# Altium project 2025 Bright MFG Challenge-MTU ECE1.PrjPcb
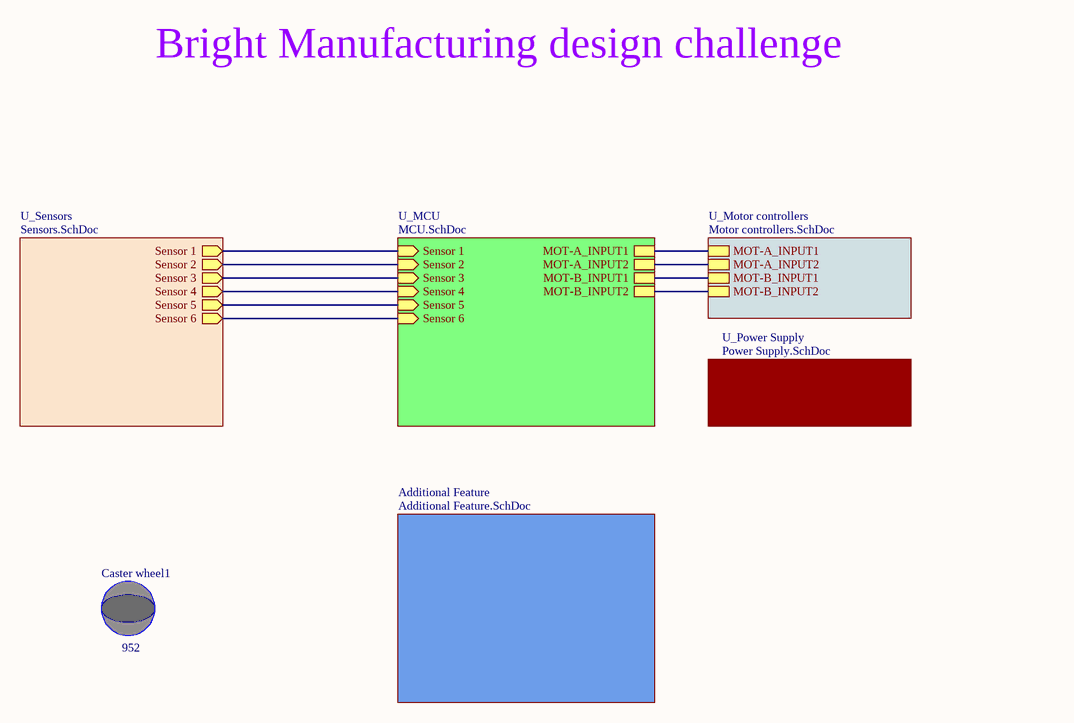
[diagram p0: Global.SchDoc]
6 sheets, 91 parts. Net scope: global (net labels, ports and power ports of the same name join across sheets).
Board file: Bright MFG Robot.PcbDoc
Sheets:
  Global.SchDoc
    U_MCU = MCU.SchDoc
    U_Motor controllers = Motor controllers.SchDoc
    U_Power Supply = Power Supply.SchDoc
    U_Sensors = Sensors.SchDoc
    Additional Feature = Additional Feature.SchDoc

## Sheet Global.SchDoc
size 431 x 279 mm; SheetNumber: 1; SheetTotal: 6

### Parts
Caster_wheel1  952  [952-Footprint-1]

### Sub-sheets
Additional Feature = Additional Feature.SchDoc: no entries
U_MCU = MCU.SchDoc: MOT-A_INPUT1, MOT-B_INPUT1, MOT-A_INPUT2, MOT-B_INPUT2, Sensor 1 (in), Sensor 2 (in), Sensor 3 (in), Sensor 4 (in), Sensor 5 (in), Sensor 6 (in)
U_Motor controllers = Motor controllers.SchDoc: MOT-A_INPUT1, MOT-B_INPUT1, MOT-A_INPUT2, MOT-B_INPUT2
U_Power Supply = Power Supply.SchDoc: no entries
U_Sensors = Sensors.SchDoc: Sensor 1 (out), Sensor 2 (out), Sensor 3 (out), Sensor 4 (out), Sensor 5 (out), Sensor 6 (out)

### Nets
(unnamed): sheet U_MCU/MOT-A_INPUT1, sheet U_Motor controllers/MOT-A_INPUT1
(unnamed): sheet U_MCU/MOT-B_INPUT1, sheet U_Motor controllers/MOT-B_INPUT1
(unnamed): sheet U_MCU/MOT-A_INPUT2, sheet U_Motor controllers/MOT-A_INPUT2
(unnamed): sheet U_MCU/MOT-B_INPUT2, sheet U_Motor controllers/MOT-B_INPUT2
(unnamed): sheet U_MCU/Sensor 1, sheet U_Sensors/Sensor 1
(unnamed): sheet U_MCU/Sensor 2, sheet U_Sensors/Sensor 2
(unnamed): sheet U_MCU/Sensor 3, sheet U_Sensors/Sensor 3
(unnamed): sheet U_MCU/Sensor 4, sheet U_Sensors/Sensor 4
(unnamed): sheet U_MCU/Sensor 5, sheet U_Sensors/Sensor 5
(unnamed): sheet U_MCU/Sensor 6, sheet U_Sensors/Sensor 6

### Notes on the sheet
- Bright Manufacturing design challenge
- 4
- 3
- DWG NO.
- REV
- 2
- 1
- DESCRIPTION
- ECO #
- DATE
- ALL INFORMATION IN THIS DRAWING IS THE PROPERTY OF EMAC, AND CANNOT BE COPIED OR USED WITHOUT THE WRITTEN APPROVAL OF EMAC.
- D
- C
- B
- TOLERANCES :
- DIMENSIONS ARE IN INCHES
- UNLESS OTHERWISE SPECIFIED
- CONTRACT NO.
- DRAWN BY
- 2025 Bright Manufacturing Challenge
- .XX
- .XXX
- SURFACE FINISH =           OR BETTER
- ±
- .005
- .01
- FRACTIONS
- ANGLES
- 63
- 1/64
- °
- CHECKED BY
- SCHEMATIC
- A
- MATERIAL
- DRAWING PER ASME-Y14.5-1994
- DEBURR & BREAK ALL SHARP EDGES.
- RESP ENGR
- SIZE
- CODE IDENT
- 0BJZ8
- FINISH
- DESIGN ACTIVITY APPROVAL
- NONE
- SCALE
- WEIGHT
- NA
- SHEET
- OF
- REV. A, 06/21/2025
- FORM #PDE-0001-0001

### Library data of the parts
Caster_wheel1 = CMP-00025-1: Ball Caster With 1/2" Plastic

## Sheet MCU.SchDoc: Master Controller Unit (MCU)
size 431 x 279 mm; DocumentNumber: BMC-125-5321; Revision: A; SheetNumber: 5; SheetTotal: 6
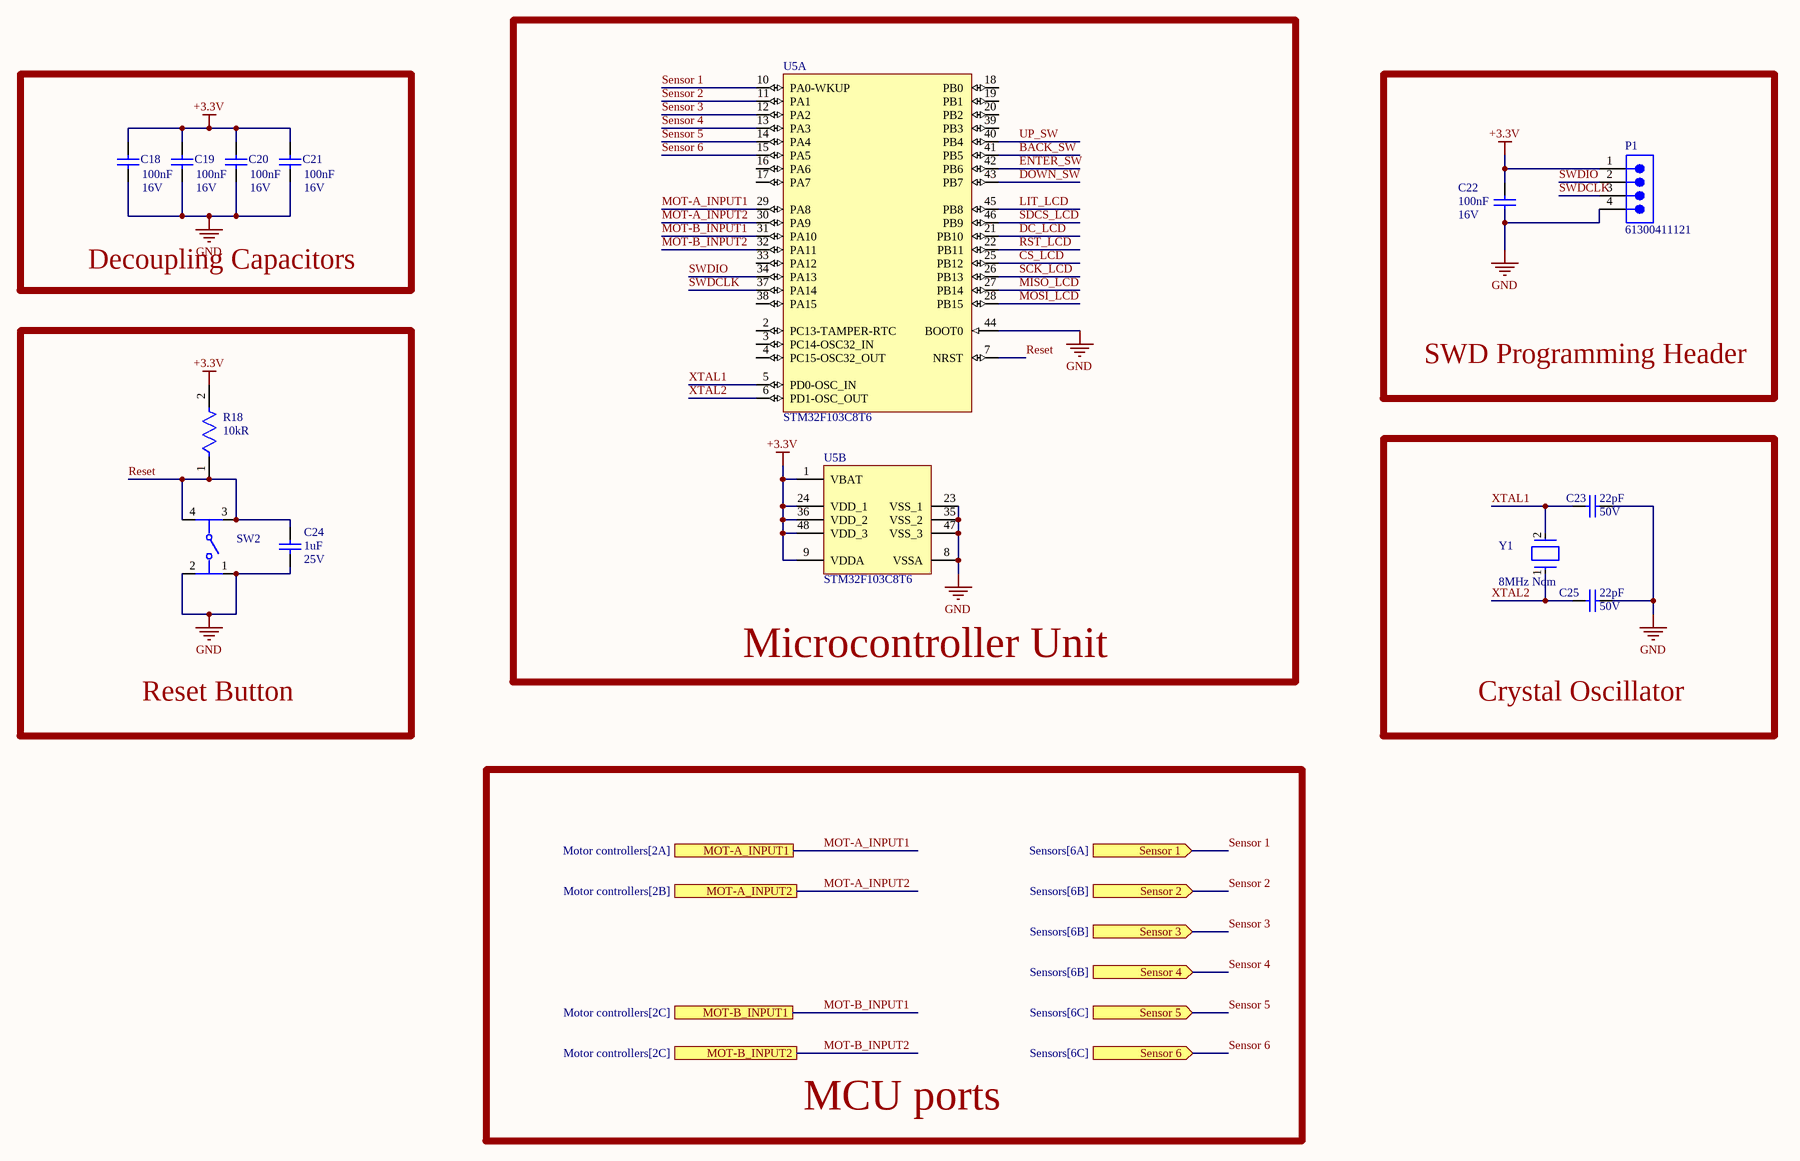
[diagram p1: MCU.SchDoc]

### Parts
C18  value 100nF  Rated DC Voltage (URdc): 16V  [CAPC1608X90X35LL15T15]  (hidden comment: 0.1uF 16V 0603)
C19  value 100nF  Rated DC Voltage (URdc): 16V  [CAPC1608X90X35LL15T15]  (hidden comment: 0.1uF 16V 0603)
C20  value 100nF  Rated DC Voltage (URdc): 16V  [CAPC1608X90X35LL15T15]  (hidden comment: 0.1uF 16V 0603)
C21  value 100nF  Rated DC Voltage (URdc): 16V  [CAPC1608X90X35LL15T15]  (hidden comment: 0.1uF 16V 0603)
C22  value 100nF  Rated DC Voltage (URdc): 16V  [CAPC1608X90X35LL15T15]  (hidden comment: 0.1uF 16V 0603)
C23  value 22pF  Voltage Rating: 50V  [FP-C0603C-CF-IPC_B]  (hidden comment: 22pF 50V 0603)
C24  value 1uF  Rated DC Voltage (URdc): 25V  [FP-CC0603-DA-IPC_B]  (hidden comment: 1uF 25V 0603)
C25  value 22pF  Voltage Rating: 50V  [FP-C0603C-CF-IPC_B]  (hidden comment: 22pF 50V 0603)
P1  61300411121  [61300411121]
R18  value 10kR  [RESC1608X55X25ML10T15]  (hidden comment: 10KOhm 0603)
SW2  PTS645SM43SMTR92LFS  [FP-PTS645SM43SMTR92LFS-MFG]  (value not drawn)
U5  STM32F103C8T6  [STM-LQFP48_M]  (parts A,B of 2)
Y1  ABLS2-8.000MHZ-D4Y-T  [FP-ABLS2-MFG]  (value not drawn)

### Blocks framed on the sheet
Microcontroller Unit: U5
Decoupling Capacitors: C18-C21
SWD Programming Header: C22 P1
Reset Button: C24 R18 SW2
Crystal Oscillator: C23 C25 Y1

### Ports
MOT-A_INPUT1 (see Motor controllers[2A]), MOT-A_INPUT2 (see Motor controllers[2B]), MOT-B_INPUT1 (see Motor controllers[2C]), MOT-B_INPUT2 (see Motor controllers[2C]), Sensor 1 (in, see Sensors[6A]), Sensor 2 (in, see Sensors[6B]), Sensor 3 (in, see Sensors[6B]), Sensor 4 (in, see Sensors[6B]), Sensor 5 (in, see Sensors[6C]), Sensor 6 (in, see Sensors[6C])

### Nets
+3.3V: C18.2 C19.2 C20.2 C21.2 C22.2 P1.1 R18.2 U5.1(VBAT) U5.9(VDDA) U5.24(VDD_1) U5.36(VDD_2) U5.48(VDD_3)
GND: C18.1 C19.1 C20.1 C21.1 C22.1 C23.1 C24.1 C25.1 P1.4 SW2.1 SW2.2 U5.8(VSSA) U5.23(VSS_1) U5.35(VSS_2) U5.44(BOOT0) U5.47(VSS_3)
BACK_SW: U5.41(PB5)
CS_LCD: U5.25(PB12)
DC_LCD: U5.21(PB10)
DOWN_SW: U5.43(PB7)
ENTER_SW: U5.42(PB6)
LIT_LCD: U5.45(PB8)
MISO_LCD: U5.27(PB14)
MOSI_LCD: U5.28(PB15)
MOT-A_INPUT1: U5.29(PA8) ; port MOT-A_INPUT1
MOT-A_INPUT2: U5.30(PA9) ; port MOT-A_INPUT2
MOT-B_INPUT1: U5.31(PA10) ; port MOT-B_INPUT1
MOT-B_INPUT2: U5.32(PA11) ; port MOT-B_INPUT2
Reset: C24.2 R18.1 SW2.3 SW2.4 U5.7(NRST)
RST_LCD: U5.22(PB11)
SCK_LCD: U5.26(PB13)
SDCS_LCD: U5.46(PB9)
Sensor 1: U5.10(PA0-WKUP) ; port Sensor 1
Sensor 2: U5.11(PA1) ; port Sensor 2
Sensor 3: U5.12(PA2) ; port Sensor 3
Sensor 4: U5.13(PA3) ; port Sensor 4
Sensor 5: U5.14(PA4) ; port Sensor 5
Sensor 6: U5.15(PA5) ; port Sensor 6
SWDCLK: P1.3 U5.37(PA14)
SWDIO: P1.2 U5.34(PA13)
UP_SW: U5.40(PB4)
XTAL1: C23.2 U5.5(PD0-OSC_IN) Y1.2
XTAL2: C25.2 U5.6(PD1-OSC_OUT) Y1.1

Not connected (* = marked no-connect by the designer): U5 2(PC13-TAMPER-RTC) 3(PC14-OSC32_IN) 4(PC15-OSC32_OUT) 16(PA6) 17(PA7) 18(PB0) 19(PB1) 20(PB2) 33(PA12) 38(PA15) 39(PB3)

### Notes on the sheet
- MCU ports
- 4
- 3
- DWG NO.
- REV
- 2
- 1
- ALL INFORMATION IN THIS DRAWING IS THE PROPERTY OF EMAC, AND CANNOT BE COPIED OR USED WITHOUT THE WRITTEN APPROVAL OF EMAC.
- D
- C
- B
- 2025 Bright Manufacturing Challenge
- SCHEMATIC
- A
- SIZE
- CODE IDENT
- 0BJZ8
- NONE
- SCALE
- WEIGHT
- NA
- SHEET
- OF
- REV. A, 06/21/2025
- FORM #PDE-0001-0001

### Library data of the parts
C18-C22 = CMP-00000-2: Ceramic Capacitor, Multilayer, Ceramic, 16V, 10% +Tol, 10% -Tol, X7R, 15% TC, 0.1uF, Surface Mount, 0603; Multilayer: Yes; Reference Standard: AEC-Q200; Height: 0.9mm; Capacitor Type: Ceramic; Case/Package: 0603; Dielectric Material: Ceramic; JESD-609 Code: e3; Length: 1.6mm; Max Operating Temperature: 125°C; Min Operating Temperature: -55°C; Mounting Technology: Surface Mount; Package Shape: Rectangular; Package Style: SMTMeter; Packaging: Tape and Reel; Pins: 2; Reach SVHC Compliant: Yes; RoHS Compliant: Yes; Temperature Characteristics Code: X7R; Terminal Finish: Nickel; Termination: Wraparound; Tolerance  (fill in as +-): 10%; Tolerance (fill in as +-): 10%; Width: 0.81mm
C23 C25 = CMP-00009-2: Ceramic Capacitor, Multilayer, Ceramic, 50V, 5% +Tol, 5% -Tol, C0G, 30ppm/Cel TC, 0.000022uF, Surface Mount, 0603; Multilayer: Yes; Height: 0.8mm; Capacitor Type: Ceramic; Case/Package: 0603; Dielectric Material: Ceramic; JESD-609 Code: e3; Length: 1.6mm; Max Operating Temperature: 125°C; Min Operating Temperature: -55°C; Mounting Technology: Surface Mount; Package Shape: Rectangular; Package Style: SMTMeter; Packaging: Tape and Reel; Pins: 2; Rated DC Voltage (URdc): 50V; Reach SVHC Compliant: Yes; RoHS Compliant: Yes; Temperature Characteristics Code: C0G; Terminal Finish: Nickel; Termination: Wraparound; Tolerance  (fill in as +-): 5%; Tolerance (fill in as +-): 5%; Width: 0.8mm
C24 = CMP-00002-5: Ceramic Capacitor, Multilayer, Ceramic, 25V, 10% +Tol, 10% -Tol, X5R, 15% TC, 1uF, Surface Mount, 0603; Multilayer: Yes; Height: 0.8mm; Capacitor Type: Ceramic; Case/Package: 0603; Dielectric Material: Ceramic; JESD-609 Code: e3; Length: 1.6mm; Max Operating Temperature: 85°C; Min Operating Temperature: -55°C; Mounting Technology: Surface Mount; Package Shape: Rectangular; Package Style: SMTMeter; Packaging: Tape and Reel; Pins: 2; Reach SVHC Compliant: Yes; RoHS Compliant: Yes; Temperature Characteristics Code: X5R; Terminal Finish: Nickel; Termination: Wraparound; Tolerance  (fill in as +-): 10%; Tolerance (fill in as +-): 10%; Width: 0.8mm; Voltage Rating: 25V
P1 = CMP-00013-1: Board Connector, 4 Contact(s), 1 Row(s), Male, Straight, 0.1 inch Pitch, Solder Terminal, Locking, Black Insulator, Plug; Contact Resistance: 20mR; Number of Contacts: 4; Body Length: 0.4inch; Contact Pattern: RECTANGULAR; Contact Style: SQ PIN-SKT; Dielectric Withstanding Voltage (AC): 500V; Insulation Resistance: 1GR; Number Of Connectors: 1; Rated Current (Signal): 3A; Reference Standard: UL; Reliability: COMMERCIAL; Termination: Solder; Min Operating Temperature: -40°C; Connector Type: BOARD CONNECTOR; Max Operating Temperature: 125°C; Contact Material: Copper Alloy; Body/Shell Style: PLUG; Body Breadth: 0.1inch; Body Depth: 0.1inch; Contact Finish - Mating: GOLD; Contact Finish - Termination: Gold (Au) - with Nickel (Ni) barrier; Contact Gender: Male; Insulation Color: Black; Insulation Material: Polybutylene; JESD-609 Code: e4; Mating Contact Pitch: 0.1inch; Mounting Option 1: LOCKING; Mounting Style: STRAIGHT; Mounting Technology: Board; Number of Rows Loaded: 1; PCB Contact Pattern: RECTANGULAR; Reach SVHC Compliant: Yes; RoHS Compliant: Yes; Terminal Length: 0.118inch; Terminal Pitch: 2.54mm
R18 = CMP-00018-1: Fixed Resistor, Metal Glaze/thick Film, 0.1W, 10000ohm, 75V, 5% +/-Tol, 100ppm/Cel, Surface Mount, 0603; Additional Feature: LASER TRIMMABLE; Package Height: 0.45mm; Package Length: 1.6mm; Package Width: 0.8mm; Power: 100mW; Rated Temperature: 70°C; Temperature Coefficient (ppm/Cel): 100; Packaging: Tape and Reel; Tolerance: 5%; Case/Package: 0603; Construction: Chip; JESD-609 Code: e3; Max Operating Temperature: 155°C; Min Operating Temperature: -55°C; Mounting Technology: Surface Mount; Package Shape: Rectangular; Pins: 2; Reach SVHC Compliant: Yes; Resistor Type: FIXED RESISTOR; RoHS Compliant: Yes; Technology: METAL GLAZE/THICK FILM; Terminal Finish: Nickel; Termination: Wraparound; Working Voltage: 75V
SW2 = CMP-00020-2: Keypad Switch, 1 Switches, SPST, Momentary-tactile, 0.05A, 12VDC, 1.57N, 4 PCB Hole Cnt, Solder Terminal, Surface Mount-straight; Contact Resistance: 0.1mR; Actuator Type: Pushbutton; Body Breadth: 5.9944mm; Body Height: 3.4544mm; Contact Current(DC)-Max: 50mA; Contact DC Max Rating R Load: 0.05A@12VDC; Contact Voltage(DC)-Max: 12V; Dielectric Withstand Volts: 250VACV; Insulation Resistance: 100GR; PCB Hole Count: 4; Min Operating Temperature: -20°C; Termination: Solder; Switch Function: SPST; Max Operating Temperature: 60°C; Body Length or Diameter: 5.9944mm; JESD-609 Code: e4; Mounting Technology: Surface Mount; Reach SVHC Compliant: Yes; RoHS Compliant: Yes; Switch Action: MOMENTARY; Switch Type: Keypad; Terminal Finish: Silver; Terminal Length: 0.138inch
U5 = CMP-00023-5: RISC Microcontroller, 32-Bit, FLASH, STM32 CPU, 72MHz, CMOS, PQFP48; Clock Frequency: 16MHz; Interface: I2C,SPI,USB,CAN,USART; Max Supply Current: 50mA; Max Supply Voltage: 3.6V; Min Supply Voltage: 2V; Nominal Supply Voltage: 3.3V; Number of I/O Lines: 37; Package Body Material: Plastic; Package Equivalence Code: QFP48,.35SQ,20; Peripherals: POR,DMA; Power Supplies: 2.5/3.3; Qualification Status: Not Qualified; Time @ Peak Reflow Temperature-Max (s): 30s; Case/Package: LFQFP; Height - Seated (Max): 1.6mm; JESD-30 Code: S-PQFP-G48; JESD-609 Code: e4; Length: 7mm; Max Operating Temperature: 105°C; Min Operating Temperature: -40°C; Moisture Sensitivity Level: 2; Package Shape: Square; Peak Reflow Temperature (Cel): 260°C; Pins: 48; Reach SVHC Compliant: Yes; RoHS Compliant: Yes; Surface Mount: Yes; Technology: CMOS; Temperature Grade: INDUSTRIAL; Terminal Finish: Nickel; Terminal Form: Gull Wing; Terminal Pitch: 0.5mm; Terminal Position: QUAD; Width: 7mm
Y1 = CMP-00024-1: 8MHz Nom; Load Capacitance: 18pF; Frequency Tolerance: 30ppm; Frequency Stability: 0.003%; Aging: 5 PPM/FIRST YEAR; Crystal/Resonator Type: PARALLEL - FUNDAMENTAL; Drive Level: 100uW; ESR: 80R; Operating Frequency-Nom: 80; Min Operating Temperature: -40°C; RoHS Compliant: Yes; Max Operating Temperature: 85°C; JESD-609 Code: e3; Mounting Technology: Surface Mount; Reach SVHC Compliant: Yes; Terminal Finish: Tin; Operating Frequency: 8MHz Nom

## Sheet Motor controllers.SchDoc: Motor Controllers
size 431 x 279 mm; ApprovedBy: John Watson; DrawnBy: Medhi; DocumentNumber: BMC-125-5321; Revision: A; SheetNumber: 3; SheetTotal: 6
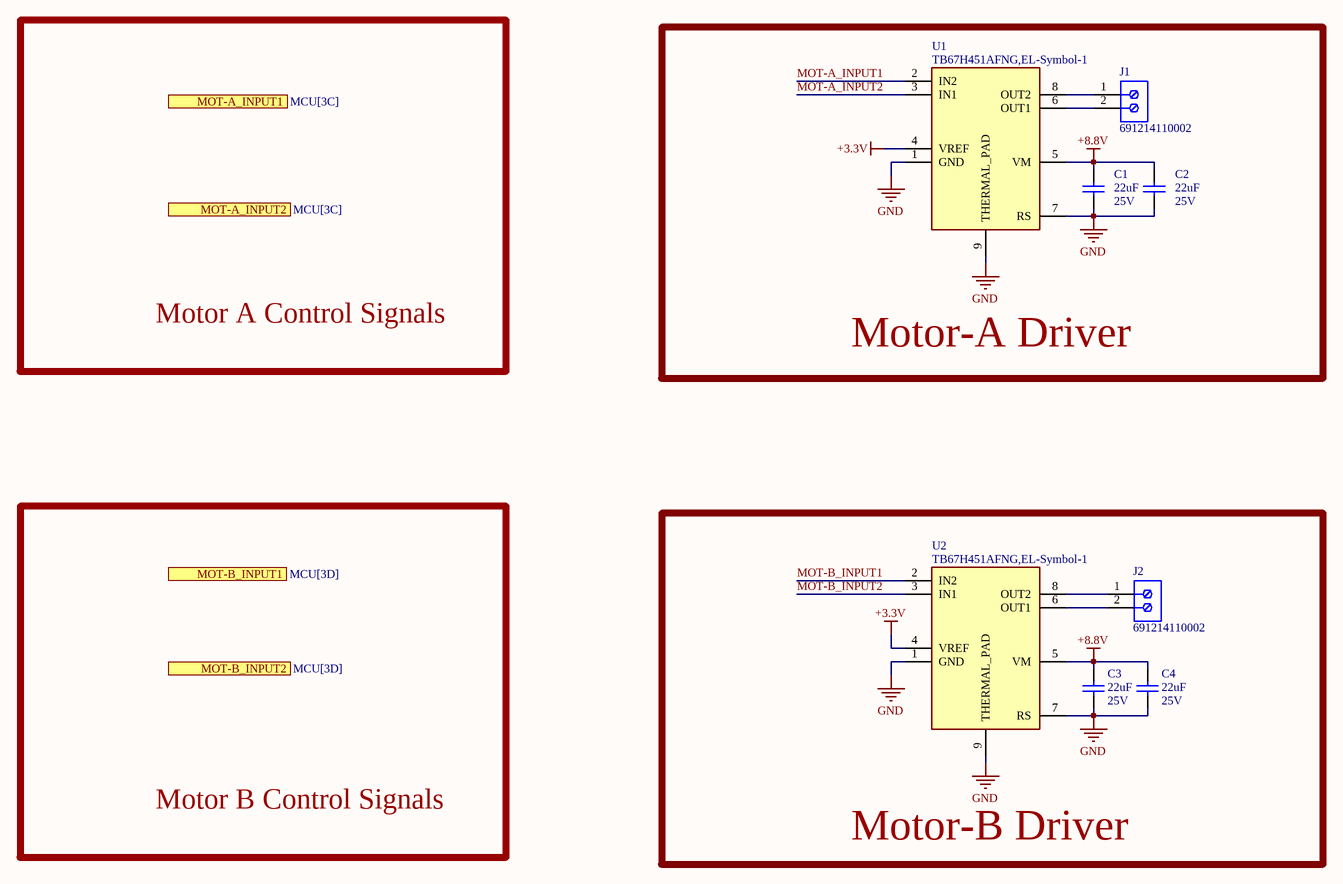
[diagram p2: Motor controllers.SchDoc]

### Parts
C1  value 22uF  Rated DC Voltage (URdc): 25V  [CAPC320160X160_CL31H-0_2_M]  (hidden comment: 22uF 25V 1206)
C2  value 22uF  Rated DC Voltage (URdc): 25V  [CAPC320160X160_CL31H-0_2_M]  (hidden comment: 22uF 25V 1206)
C3  value 22uF  Rated DC Voltage (URdc): 25V  [CAPC320160X160_CL31H-0_2_M]  (hidden comment: 22uF 25V 1206)
C4  value 22uF  Rated DC Voltage (URdc): 25V  [CAPC320160X160_CL31H-0_2_M]  (hidden comment: 22uF 25V 1206)
J1  691214110002  [691214110002]
J2  691214110002  [691214110002]
U1  TB67H451AFNG,EL-Symbol-1  [SOIC127P600X170-9N]
U2  TB67H451AFNG,EL-Symbol-1  [SOIC127P600X170-9N]

### Blocks framed on the sheet
Motor-A Driver: C1 C2 J1 U1
Motor-B Driver: C3 C4 J2 U2

### Ports
MOT-A_INPUT1 (see MCU[3C]), MOT-A_INPUT2 (see MCU[3C]), MOT-B_INPUT1 (see MCU[3D]), MOT-B_INPUT2 (see MCU[3D])

### Nets
+3.3V: U1.4(VREF) U2.4(VREF)
+8.8V: C1.2 C2.2 C3.2 C4.2 U1.5(VM) U2.5(VM)
GND: C1.1 C2.1 C3.1 C4.1 U1.1(GND) U1.7(RS) U1.9(THERMAL_PAD) U2.1(GND) U2.7(RS) U2.9(THERMAL_PAD)
MOT-A_INPUT1: U1.2(IN2) ; port MOT-A_INPUT1
MOT-A_INPUT2: U1.3(IN1) ; port MOT-A_INPUT2
MOT-B_INPUT1: U2.2(IN2) ; port MOT-B_INPUT1
MOT-B_INPUT2: U2.3(IN1) ; port MOT-B_INPUT2
NetJ1_1: J1.1 U1.8(OUT2)
NetJ1_2: J1.2 U1.6(OUT1)
NetJ2_1: J2.1 U2.8(OUT2)
NetJ2_2: J2.2 U2.6(OUT1)

### Notes on the sheet
- Motor A Control Signals
- Motor B Control Signals
- 4
- 3
- DWG NO.
- REV
- 2
- 1
- ALL INFORMATION IN THIS DRAWING IS THE PROPERTY OF EMAC, AND CANNOT BE COPIED OR USED WITHOUT THE WRITTEN APPROVAL OF EMAC.
- D
- C
- B
- 2025 Bright Manufacturing Challenge
- SCHEMATIC
- A
- SIZE
- CODE IDENT
- 0BJZ8
- NONE
- SCALE
- WEIGHT
- NA
- SHEET
- OF
- REV. A, 06/21/2025
- FORM #PDE-0001-0001

### Library data of the parts
C1-C4 = CMP-00001-4: Ceramic Capacitor, Multilayer, Ceramic, 25V, 10% +Tol, 10% -Tol, X5R, 15% TC, 22uF, Surface Mount, 1206; Multilayer: Yes; Max Operating Temperature: 85°C; Min Operating Temperature: -55°C; Case/Package: 1206; Height: 1.8mm; Capacitor Type: Ceramic; Dielectric Material: Ceramic; JESD-609 Code: e3; Length: 3.2mm; Mounting Technology: Surface Mount; Package Shape: Rectangular; Package Style: SMTMeter; Packaging: Tape and Reel; Pins: 2; Reach SVHC Compliant: Yes; RoHS Compliant: Yes; Temperature Characteristics Code: X5R; Terminal Finish: Nickel; Termination: Wraparound; Tolerance  (fill in as +-): 10%; Tolerance (fill in as +-): 10%; Width: 1.6mm
J1 J2 = CMP-00011-1: Barrier Strip Terminal Block; Reach SVHC Compliant: No; RoHS Compliant: Yes; Terminal and Terminal Block Type: BARRIER STRIP TERMINAL BLOCK
U1 U2 = CMP-00027-3: PWM Chopper Type DC Brushed Motor Driver 24V 8-Pin HSOP; Type: Motor Driver

## Sheet Power Supply.SchDoc: Power Supply
size 431 x 279 mm; DocumentNumber: BMC-125-5321; Revision: A; SheetNumber: 4; SheetTotal: 6
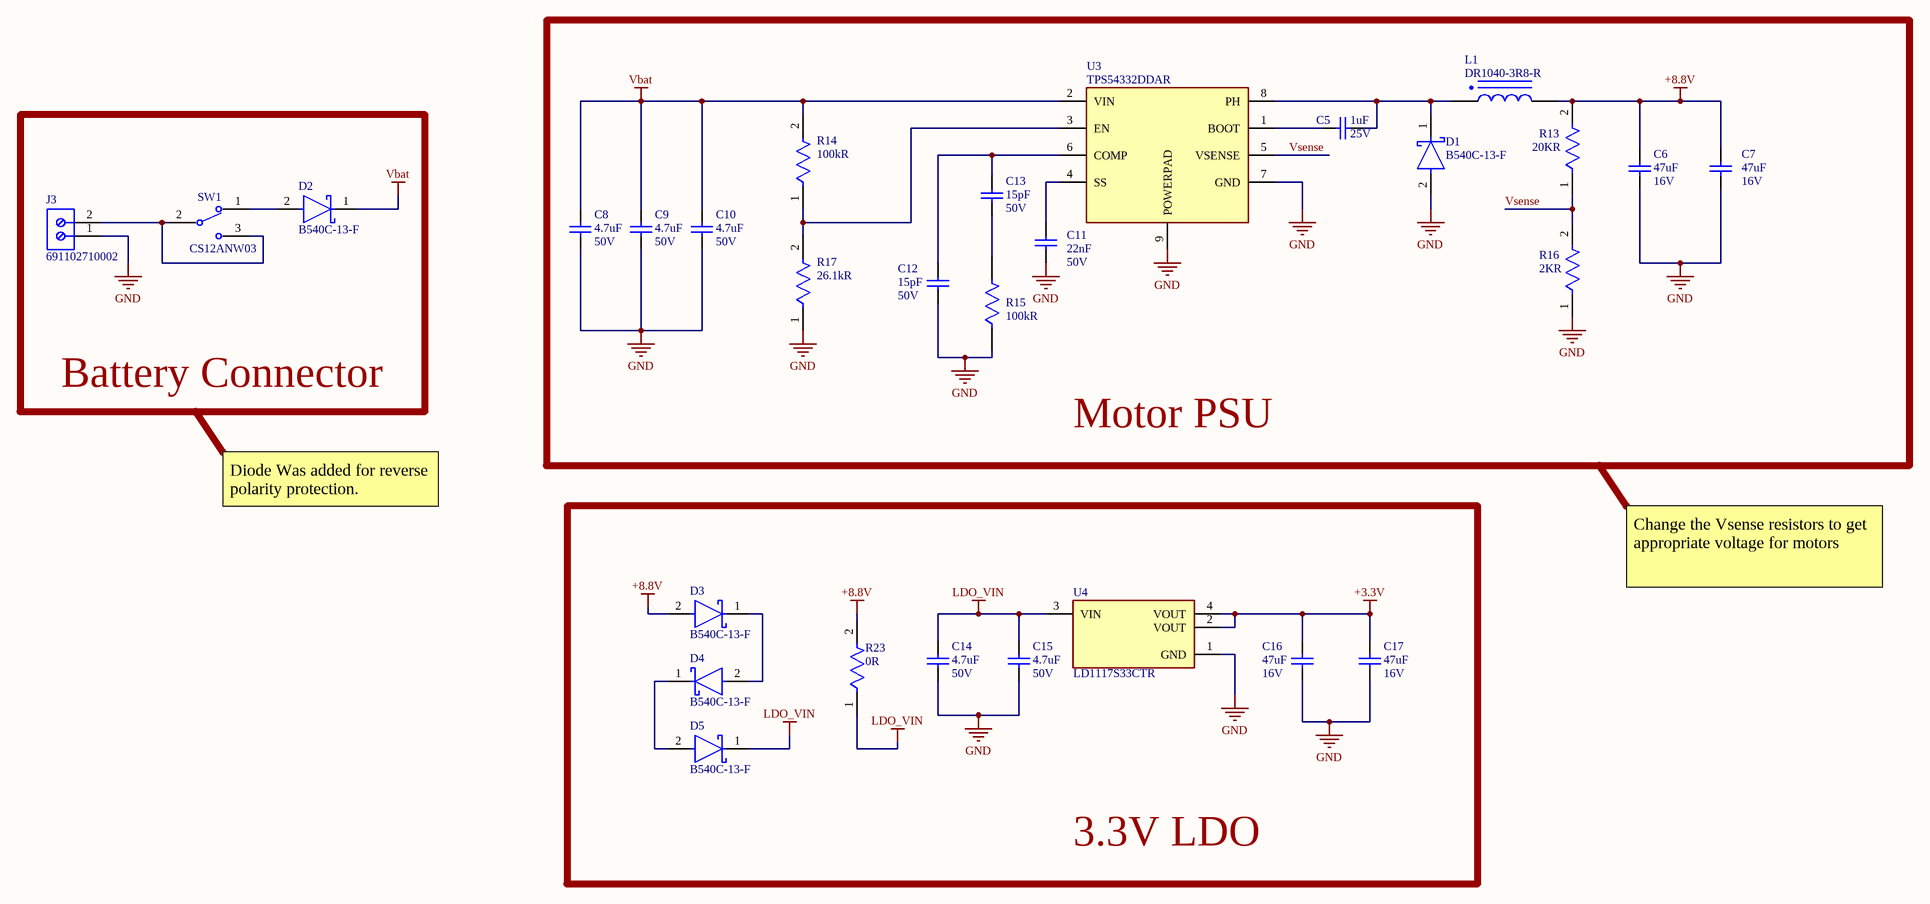
[diagram p3: Power Supply.SchDoc]

### Parts
C5  value 1uF  Voltage Rating: 25V  [FP-CC0603-DA-IPC_B]  (hidden comment: 1uF 25V 0603)
C6  value 47uF  Voltage Rating: 16V  [FP-1210-L_3_2_0_3-W_2_5_0-MFG]  (hidden comment: 47uF 16V 1210)
C7  value 47uF  Voltage Rating: 16V  [FP-1210-L_3_2_0_3-W_2_5_0-MFG]  (hidden comment: 47uF 16V 1210)
C8  value 4.7uF  Voltage Rating: 50V  [FP-GRM21B-0_15-IPC_A]  (hidden comment: 4.7uF 50V 0805)
C9  value 4.7uF  Voltage Rating: 50V  [FP-GRM21B-0_15-IPC_A]  (hidden comment: 4.7uF 50V 0805)
C10  value 4.7uF  Voltage Rating: 50V  [FP-GRM21B-0_15-IPC_A]  (hidden comment: 4.7uF 50V 0805)
C11  value 22nF  Voltage Rating: 50V  [FP-C2012-125-0_2-IPC_A]  (hidden comment: .022uF 50V 0805)
C12  value 15pF  Voltage Rating: 50V  [FP-CC0603-0_9-IPC_A]  (hidden comment: 15pF 50V 0603)
C13  value 15pF  Voltage Rating: 50V  [FP-CC0603-0_9-IPC_A]  (hidden comment: 15pF 50V 0603)
C14  value 4.7uF  Rated DC Voltage (URdc): 50V  [FP-GRM21B-0_15-IPC_A]  (hidden comment: 4.7uF 50V 0805)
C15  value 4.7uF  Rated DC Voltage (URdc): 50V  [FP-GRM21B-0_15-IPC_A]  (hidden comment: 4.7uF 50V 0805)
C16  value 47uF  Rated DC Voltage (URdc): 16V  [FP-1210-L_3_2_0_3-W_2_5_0-MFG]  (hidden comment: CAP)
C17  value 47uF  Rated DC Voltage (URdc): 16V  [FP-1210-L_3_2_0_3-W_2_5_0-MFG]  (hidden comment: CAP)
D1  B540C-13-F  [FP-SMC-MFG]
D2  B540C-13-F  [FP-SMC-MFG]
D3  B540C-13-F  [FP-SMC-MFG]
D4  B540C-13-F  [FP-SMC-MFG]
D5  B540C-13-F  [FP-SMC-MFG]
J3  691102710002  [691102710002]
L1  DR1040-3R8-R  [DR1040-3R8-R-Footprint-1]
R13  20KR  [FP-RC0603-0_55-IPC_C]
R14  value 100kR  [FP-RC0603-0_55-IPC_C]  (hidden comment: 100Kohm 0603)
R15  value 100kR  [FP-RC0603-0_55-IPC_C]  (hidden comment: 100Kohm 0603)
R16  2KR  [FP-AC0603-IPC_B]
R17  value 26.1kR  [FP-RT0603-IPC_C]  (hidden comment: 26.1K Ohm 0603)
R23  0R  [FP-RC0603-MFG]
SW1  CS12ANW03  [FP-CS12ANW03-MFG]
U3  TPS54332DDAR  [SOIC127P600X170-9N]
U4  LD1117S33CTR  [FP-SOT-223-0046067_14-MFG]

### Blocks framed on the sheet
Motor PSU: C5-C13 D1 L1 R13-R17 U3
Battery Connector: D2 J3 SW1
3.3V LDO: C14-C17 D3-D5 R23 U4

### Nets
+3.3V: C16.2 C17.2 U4.2(VOUT) U4.4(VOUT)
+8.8V: C6.2 C7.2 D3.2(A) L1.2 R13.2 R23.2
GND: C6.1 C7.1 C8.1 C9.1 C10.1 C11.1 C12.1 C14.1 C15.1 C16.1 C17.1 D1.2(A) J3.1 R15.1 R16.1 R17.1 U3.7(GND) U3.9(POWERPAD) U4.1(GND)
LDO_VIN: C14.2 C15.2 D5.1(C) R23.1 U4.3(VIN)
Vbat: C8.2 C9.2 C10.2 D2.1(C) R14.2 U3.2(VIN)
Vsense: R13.1 R16.2 U3.5(VSENSE)
NetC5_1: C5.1 D1.1(C) L1.1 U3.8(PH)
NetC5_2: C5.2 U3.1(BOOT)
NetC11_2: C11.2 U3.4(SS)
NetC12_2: C12.2 C13.2 U3.6(COMP)
NetC13_1: C13.1 R15.2
NetD2_2: D2.2(A) SW1.1
NetD3_1: D3.1(C) D4.2(A)
NetD4_1: D4.1(C) D5.2(A)
NetJ3_2: J3.2 SW1.2(2(COM)) SW1.3
NetR14_1: R14.1 R17.2 U3.3(EN)

### Notes on the sheet
- Diode Was added for reverse  polarity protection.
- Change the Vsense resistors to get appropriate voltage for motors
- 4
- 3
- DWG NO.
- REV
- 2
- 1
- ALL INFORMATION IN THIS DRAWING IS THE PROPERTY OF EMAC, AND CANNOT BE COPIED OR USED WITHOUT THE WRITTEN APPROVAL OF EMAC.
- D
- C
- B
- 2025 Bright Manufacturing Challenge
- SCHEMATIC
- A
- SIZE
- CODE IDENT
- 0BJZ8
- NONE
- SCALE
- WEIGHT
- NA
- SHEET
- OF
- REV. A, 06/21/2025
- FORM #PDE-0001-0001

### Library data of the parts
C5 = CMP-00002-5: as C24 on sheet MCU; Height: 0.8mm; Capacitor Type: Ceramic; Case/Package: 0603; Dielectric Material: Ceramic; JESD-609 Code: e3; Length: 1.6mm; Max Operating Temperature: 85°C; Min Operating Temperature: -55°C; Mounting Technology: Surface Mount; Package Shape: Rectangular; Package Style: SMTMeter; Packaging: Tape and Reel; Pins: 2; Rated DC Voltage (URdc): 25V; Reach SVHC Compliant: Yes; RoHS Compliant: Yes; Temperature Characteristics Code: X5R; Terminal Finish: Nickel; Termination: Wraparound; Tolerance  (fill in as +-): 10%; Tolerance (fill in as +-): 10%; Width: 0.8mm
C6 C7 C16 C17 = CMP-00003-4: Ceramic Capacitor, Multilayer, Ceramic, 16V, 20% +Tol, 20% -Tol, X5R, 15% TC, 47uF, Surface Mount, 1210; Multilayer: Yes; Length: 3.2mm; RoHS Compliant: Yes; Case/Package: 1210; JESD-609 Code: e3; Max Operating Temperature: 85°C; Pins: 2; Packaging: Tape and Reel; Package Style: SMTMeter; Mounting Technology: Surface Mount; Dielectric Material: Ceramic; Reach SVHC Compliant: Yes; Terminal Finish: Nickel; Package Shape: Rectangular; Temperature Characteristics Code: X5R; Height: 2.5mm; Termination: Wraparound; Min Operating Temperature: -55°C; Capacitor Type: Ceramic; Width: 2.5mm; Tolerance (fill in as +-): 20%; Tolerance  (fill in as +-): 20%
  C6 C7: Rated DC Voltage (URdc): 16V
  C16 C17: Voltage Rating: 16V
C8-C10 C14 C15 = CMP-00005-2: Ceramic Capacitor, Multilayer, Ceramic, 50V, 10% +Tol, 10% -Tol, X5R, 15% TC, 4.7uF, Surface Mount, 0805; Multilayer: Yes; Height: 1.25mm; Width: 1.25mm; Packaging: Tape and Reel; Case/Package: 0805; Min Operating Temperature: -55°C; Max Operating Temperature: 85°C; Length: 2mm; Capacitor Type: Ceramic; Dielectric Material: Ceramic; JESD-609 Code: e3; Mounting Technology: Surface Mount; Package Shape: Rectangular; Package Style: SMTMeter; Pins: 2; Reach SVHC Compliant: Yes; RoHS Compliant: Yes; Temperature Characteristics Code: X5R; Terminal Finish: Nickel; Termination: Wraparound; Tolerance  (fill in as +-): 10%; Tolerance (fill in as +-): 10%
  C8-C10: Rated DC Voltage (URdc): 50V
  C14 C15: Voltage Rating: 50V
C11 = CMP-00006-3: Ceramic Capacitor, Multilayer, Ceramic, 50V, 5% +Tol, 5% -Tol, C0G, 30ppm/Cel TC, 0.022uF, Surface Mount, 0805; Multilayer: Yes; Max Operating Temperature: 125°C; Packaging: Tape and Reel; Case/Package: 0805; Length: 2mm; Height: 1.25mm; Termination: Wraparound; Width: 1.25mm; Min Operating Temperature: -55°C; Dielectric Material: Ceramic; RoHS Compliant: Yes; Capacitor Type: Ceramic; JESD-609 Code: e3; Mounting Technology: Surface Mount; Package Shape: Rectangular; Package Style: SMTMeter; Pins: 2; Rated DC Voltage (URdc): 50V; Reach SVHC Compliant: Yes; Temperature Characteristics Code: C0G; Terminal Finish: Nickel; Tolerance  (fill in as +-): 5%; Tolerance (fill in as +-): 5%
C12 C13 = CMP-00007-2: Ceramic Capacitor, Multilayer, Ceramic, 50V, 5% +Tol, 5% -Tol, C0G, 30ppm/Cel TC, 0.000015uF, Surface Mount, 0603; Multilayer: Yes; Height: 0.8mm; Max Operating Temperature: 125°C; Width: 0.8mm; Length: 1.6mm; Packaging: Tape and Reel; RoHS Compliant: Yes; Min Operating Temperature: -55°C; Termination: Wraparound; Dielectric Material: Ceramic; Case/Package: 0603; Capacitor Type: Ceramic; JESD-609 Code: e3; Mounting Technology: Surface Mount; Package Shape: Rectangular; Package Style: SMTMeter; Pins: 2; Rated DC Voltage (URdc): 50V; Reach SVHC Compliant: Yes; Temperature Characteristics Code: C0G; Terminal Finish: Nickel; Tolerance  (fill in as +-): 5%; Tolerance (fill in as +-): 5%
D1-D5 = CMP-00010-1: Rectifier Diode, Schottky, 1 Phase, 1 Element, 5A, 40V V(RRM), Silicon; Application(s): EFFICIENCY; Forward Voltage: 550mV; Non-rep Pk Forward Current-Max: 100A; Number of Elements: 1; Package Body Material: Plastic; Qualification Status: Not Qualified; Time @ Peak Reflow Temperature-Max (s): 40s; Diode Element Material: SILICON; Diode Type: RECTIFIER; JESD-30 Code: R-PDSO-C2; JESD-609 Code: e3; Max Operating Temperature: 125°C; Max Output current: 5A; Min Operating Temperature: -55°C; Moisture Sensitivity Level: 1; Number of Phases: 1; Package Shape: Rectangular; Package Style: SMALL OUTLINEMeter; Peak Reflow Temperature (Cel): 260°C; Pins: 2; Reach SVHC Compliant: No; Rep Pk Reverse Voltage-Max: 40V; RoHS Compliant: Yes; Surface Mount: Yes; Technology: SCHOTTKY; Terminal Finish: Tin; Terminal Form: C BEND; Terminal Position: DUAL
J3 = CMP-00012-1: Barrier Strip Terminal Block; Reach SVHC Compliant: No; RoHS Compliant: Yes; Terminal and Terminal Block Type: BARRIER STRIP TERMINAL BLOCK
L1 = CMP-00026-1: General Purpose Inductor, 3.8uH, 30%, 1 Element, Ferrite-Core, SMD, 4141; Case/Size Code: 4141; Channels: 1; DC Resistance (DCR): 13mR; Inductor Application: POWER INDUCTOR; Max Current Rating: 6.4A; Package Height: 4mm; Package Length: 10.5mm; Package Width: 10.3mm; Shape/Size Description: RECTANGULAR PACKAGE; Shielding: Shielded; Test Frequency: 100kHz; Construction: Shielded; Core Material: Ferrite; Inductance-Nom (L): 3.8uH; Inductor Type: GENERAL PURPOSE INDUCTOR; Max Operating Temperature: 125°C; Min Operating Temperature: -40°C; Package Style: SMTMeter; Packaging: Tape and Reel; Pins: 2; Reach SVHC Compliant: Yes; RoHS Compliant: Yes; Surface Mount: Yes; Terminal Placement: Dual Ended; Termination: Wraparound; Tolerance: 30%
R13 = CMP-2000-06932-2: RES 20K OHM 1% 1/10W 0603; Voltage Rating: 50V; Temperature Coefficient: 100ppm/°C; Power Rating: 100mW; Height: 0.022inch; REACH SVHC: No SVHC; Case Code (Metric): 1608; Depth: 0.8mm; Tolerance: 1%; Min Operating Temperature: -55°C; Series: RC; RoHS Compliant: Yes; Resistor Type: Thick Film; Max Power Dissipation: 100mW; Features: Moisture Resistant; Max Operating Temperature: 155°C; Package Quantity: 1; Size Code: 0603; Packaging: Tape and Reel; Width: 0.031inch; Length: 0.063inch; Military Standard: Not; Technology: THICK FILM; Number of Terminations: 2; Termination: SMD/SMT; Resistance: 20kR; Construction: Rectangular; Case/Package: 0603; Number of Pins: 2; Lead Free: Lead Free; Voltage Rating (DC): 50V; Resistance Tolerance: 1%; Case Code (Imperial): 0603
R14 R15 = CMP-00015-1: Fixed Resistor, Metal Glaze/thick Film, 0.1W, 100000ohm, 75V, 1% +/-Tol, 100ppm/Cel, Surface Mount, 0603; Additional Feature: LASER TRIMMABLE; Package Height: 0.45mm; Package Length: 1.6mm; Package Width: 0.8mm; Power: 100mW; Rated Temperature: 70°C; Temperature Coefficient (ppm/Cel): 100; Packaging: Tape and Reel; Termination: Wraparound; Resistor Type: FIXED RESISTOR; Construction: Chip; Case/Package: 0603; Technology: METAL GLAZE/THICK FILM; RoHS Compliant: Yes; Working Voltage: 75V; Min Operating Temperature: -55°C; Max Operating Temperature: 155°C; Tolerance: 1%; JESD-609 Code: e3; Mounting Technology: Surface Mount; Package Shape: Rectangular; Pins: 2; Reach SVHC Compliant: Yes; Terminal Finish: Nickel
R16 = CMP-03412-037842-1: RES 2kΩ 1.00% 0.1W 0603; Tolerance: 1%; Resistance: 2kR; RoHS Compliant: Yes; Case/Package: 0603
R17 = CMP-00017-1: Fixed Resistor, Thin Film, 0.1W, 26100ohm, 75V, 0.1% +/-Tol, 25ppm/Cel, Surface Mount, 0603; Package Height: 0.45mm; Package Length: 1.6mm; Package Width: 0.8mm; Power: 100mW; Rated Temperature: 70°C; Temperature Coefficient (ppm/Cel): 25; Tolerance: 0.1%; Case/Package: 0603; Construction: Chip; Max Operating Temperature: 155°C; Min Operating Temperature: -55°C; Mounting Technology: Surface Mount; Packaging: Tape and Reel; Pins: 2; Reach SVHC Compliant: Yes; Resistor Type: FIXED RESISTOR; RoHS Compliant: Yes; Technology: THIN FILM; Termination: Wraparound; Working Voltage: 75V
R23 = CMP-2000-06925-2: RES SMD 0 OHM JUMPER 1/10W 0603; Manufacturer: Yageo; Manufacturer Part Number: RC0603FR-070RL; Tolerance: 1%; Value: 0Ω; Power Rating: 0.1W; Voltage Rating: 75V; Composition: Thick Film; Temperature Range Low: -55°C; Ipc Land Pattern Name: RESC16080X45; Lead Free: Yes; Digikey Description: RES SMD 0 OHM JUMPER 1/10W 0603; Height: 0.55mm; Automotive: No; Device Class L3: Chip SMD Resistors; Device Class L1: Passive Components; Device Class L2: Resistors; Footprint Url: http://www.yageo.com/exep/pages/download/literatures/PYu-R_Mount_10.pdf; Category: Res; Mouser Description: RC Series 0603 0.1 W 0 O Jumper Surface Mount Thick Film Chip Resistor; Resistance: 0Ω; ComponentLink2URL: http://www.yageo.com/documents/recent/PYu-RC_Group_51_RoHS_L_10.pdf; Series: RC_L; ComponentLink2Description: Datasheet; RoHS: TRUE; Temperature: -55°C to +155°C; Temperature Range High: +155°C; Package: RC0603; Octopart: https://octopart.com/rc0603fr-070rl-yageo-1180803
SW1 = CMP-00019-1: Slide Switch; RoHS Compliant: Yes; Reach SVHC Compliant: Yes; Switch Type: Slide Switch
U3 = CMP-00028-1: Switching Regulator, Current-mode, 3.5A, 1000kHz Switching Freq-Max, PDSO8; Channels: 1; Control Technique: PULSE WIDTH MODULATION; Frequency: 1.2MHz; Max Supply Voltage: 28V; Min Input Voltage: 3.5V; Nominal Supply Voltage: 12V; Package Body Material: Plastic; Package Equivalence Code: SOP8,.25; Qualification Status: Not Qualified; Switcher Configuration: BUCK; Case/Package: HLSOP; Control Mode: CURRENT-MODE; Height - Seated (Max): 1.68mm; JESD-30 Code: R-PDSO-G8; JESD-609 Code: e4; Length: 4.89mm; Max Operating Temperature: 150°C; Min Operating Temperature: -40°C; Moisture Sensitivity Level: 2; Package Shape: Rectangular; Package Style: SMALL OUTLINE, HEAT SINK/SLUG, LOW PROFILEMeter; Peak Reflow Temperature (Cel): 260°C; Pins: 8; Reach SVHC Compliant: Yes; RoHS Compliant: Yes; Surface Mount: Yes; Temperature Grade: AUTOMOTIVE; Terminal Finish: Nickel; Terminal Form: Gull Wing; Terminal Pitch: 1.27mm; Terminal Position: DUAL; Throw Configuration: SWITCHING REGULATOR; Width: 3.9mm
U4 = CMP-00022-1: Fixed Positive LDO Regulator, 3.3V, 1.3V Dropout, BIPolar, PDSO4; Min Input Voltage: 4.75V; Max Supply Voltage: 15V; Number of Outputs: 1; Dropout Voltage1-Nom: 1.1V; Output Current1-Max: 1.3A; Output Voltage1-Max: 3.44V; Output Voltage1-Min: 3.16V; Package Body Material: Plastic; Qualification Status: Not Qualified; Regulator Type: FIXED POSITIVE SINGLE OUTPUT LDO REGULATOR; Voltage Tolerance-Max: 4.2%; Case/Package: SOP; Width: 3.5mm; Length: 6.5mm; Packaging: Tape and Reel; Adjustability: FIXED; Channels: 1; Dropout Voltage1-Max: 1.3V; Height - Seated (Max): 1.9mm; Input Voltage Absolute-Max: 15V; JESD-30 Code: R-PDSO-G3; JESD-609 Code: e3; Moisture Sensitivity Level: 1; Operating Temperature, TJ-Max: 125°C; Operating Temperature, TJ-Min: -40°C; Output Voltage1-Nom: 3.3V; Package Shape: Rectangular; Pins: 3; Reach SVHC Compliant: No; RoHS Compliant: Yes; Surface Mount: Yes; Technology: BIPOLAR; Terminal Finish: Tin; Terminal Form: Gull Wing; Terminal Pitch: 2.3mm; Terminal Position: DUAL

## Sheet Sensors.SchDoc: Sensors
size 431 x 279 mm; Date: 06/01/2025; ApprovedBy: John Watson; CheckedBy: John Watson; Author: Mehdi Kacem; DrawnBy: Mehdi Kacem; Engineer: Mehdi Kacem; DocumentNumber: BMC-125-5321; Revision: A; SheetNumber: 2; SheetTotal: 6
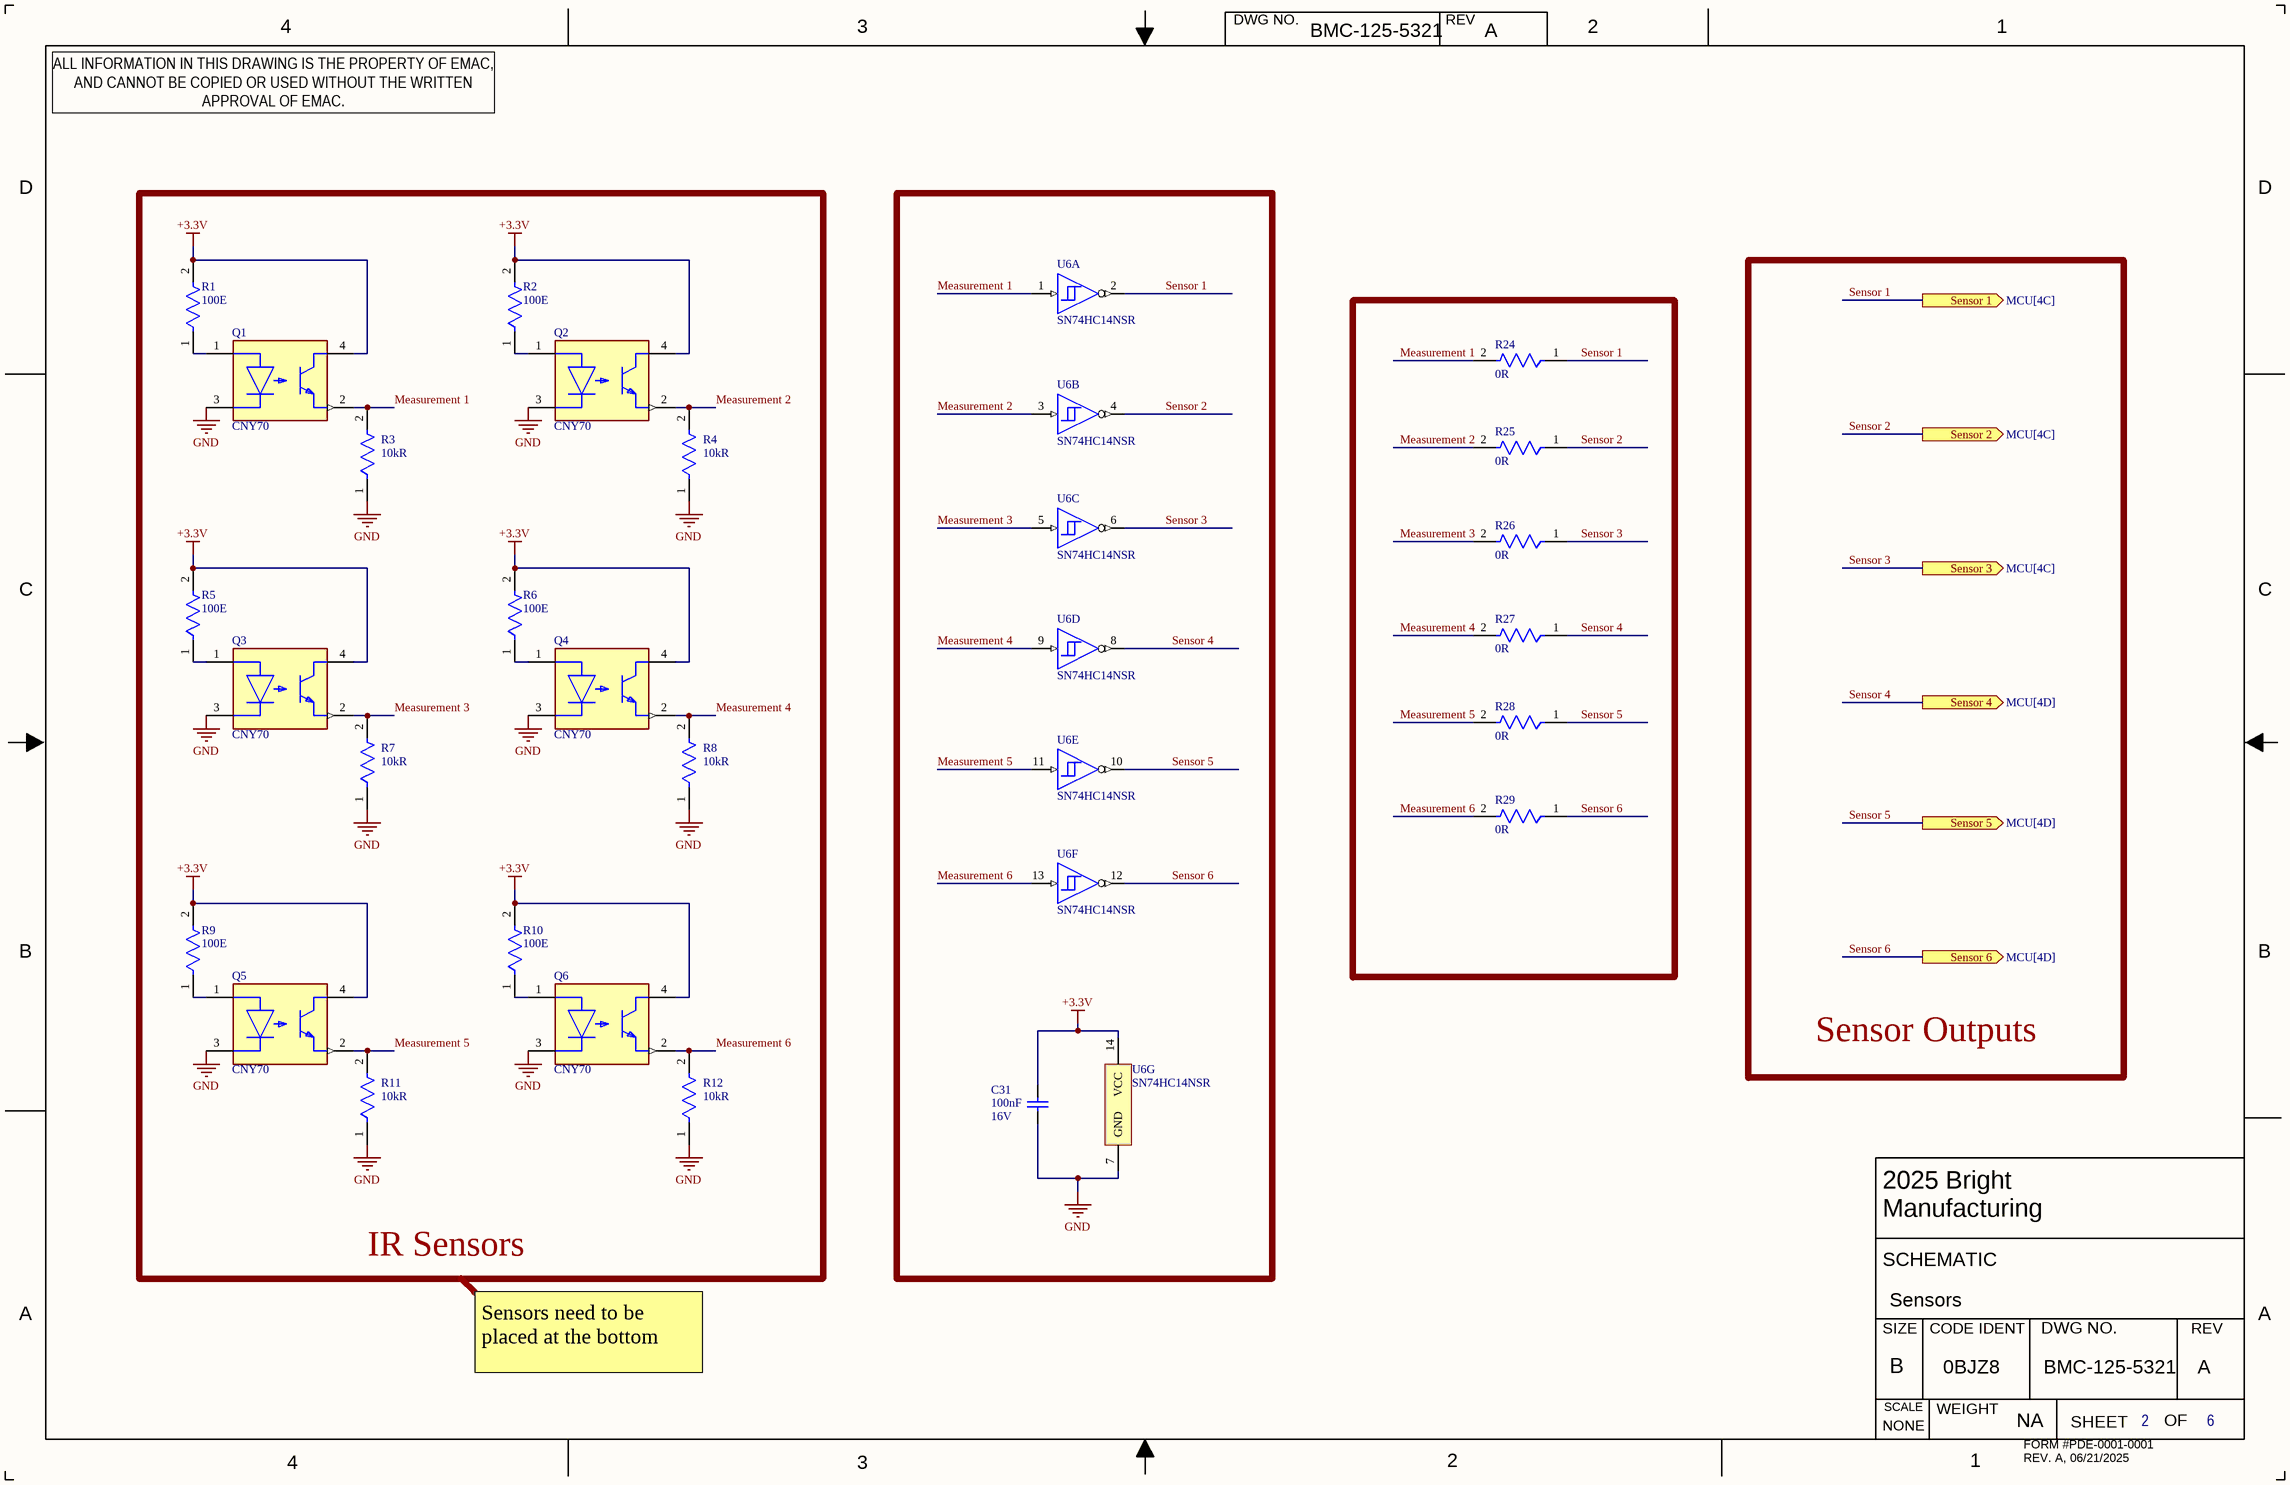
[diagram p4: Sensors.SchDoc]

### Parts
C31  value 100nF  Rated DC Voltage (URdc): 16V  [CAPC1608X90X35LL15T15]  (hidden comment: 0.1uF 16V 0603)
Q1  CNY70  [FP-6_544-5062_01-4-MFG]
Q2  CNY70  [FP-6_544-5062_01-4-MFG]
Q3  CNY70  [FP-6_544-5062_01-4-MFG]
Q4  CNY70  [FP-6_544-5062_01-4-MFG]
Q5  CNY70  [FP-6_544-5062_01-4-MFG]
Q6  CNY70  [FP-6_544-5062_01-4-MFG]
R1  100E  [FP-RT0603-MFG]
R2  100E  [FP-RT0603-MFG]
R3  value 10kR  [RESC1608X55X25ML10T15]  (hidden comment: 10KOhm 0603)
R4  value 10kR  [RESC1608X55X25ML10T15]  (hidden comment: 10KOhm 0603)
R5  100E  [FP-RT0603-MFG]
R6  100E  [FP-RT0603-MFG]
R7  value 10kR  [RESC1608X55X25ML10T15]  (hidden comment: 10KOhm 0603)
R8  value 10kR  [RESC1608X55X25ML10T15]  (hidden comment: 10KOhm 0603)
R9  100E  [FP-RT0603-MFG]
R10  100E  [FP-RT0603-MFG]
R11  value 10kR  [RESC1608X55X25ML10T15]  (hidden comment: 10KOhm 0603)
R12  value 10kR  [RESC1608X55X25ML10T15]  (hidden comment: 10KOhm 0603)
R24  0R  [FP-RC0603-MFG]
R25  0R  [FP-RC0603-MFG]
R26  0R  [FP-RC0603-MFG]
R27  0R  [FP-RC0603-MFG]
R28  0R  [FP-RC0603-MFG]
R29  0R  [FP-RC0603-MFG]
U6  SN74HC14NSR  [NS0014A_N]  (parts A,B,C,D,E,F,G of 7)

### Blocks framed on the sheet
IR Sensors: Q1-Q6 R1-R12

### Ports
Sensor 1 (out, see MCU[4C]), Sensor 2 (out, see MCU[4C]), Sensor 3 (out, see MCU[4C]), Sensor 4 (out, see MCU[4D]), Sensor 5 (out, see MCU[4D]), Sensor 6 (out, see MCU[4D])

### Nets
+3.3V: C31.2 Q1.4(C) Q2.4(C) Q3.4(C) Q4.4(C) Q5.4(C) Q6.4(C) R1.2 R2.2 R5.2 R6.2 R9.2 R10.2 U6.14(VCC)
GND: C31.1 Q1.3(C) Q2.3(C) Q3.3(C) Q4.3(C) Q5.3(C) Q6.3(C) R3.1 R4.1 R7.1 R8.1 R11.1 R12.1 U6.7(GND)
Measurement 1: Q1.2(E) R3.2 R24.2 U6.1(1A)
Measurement 2: Q2.2(E) R4.2 R25.2 U6.3(2A)
Measurement 3: Q3.2(E) R7.2 R26.2 U6.5(3A)
Measurement 4: Q4.2(E) R8.2 R27.2 U6.9(4A)
Measurement 5: Q5.2(E) R11.2 R28.2 U6.11(5A)
Measurement 6: Q6.2(E) R12.2 R29.2 U6.13(6A)
Sensor 1: R24.1 U6.2(~{1Y}) ; port Sensor 1
Sensor 2: R25.1 U6.4(~{2Y}) ; port Sensor 2
Sensor 3: R26.1 U6.6(~{3Y}) ; port Sensor 3
Sensor 4: R27.1 U6.8(~{4Y}) ; port Sensor 4
Sensor 5: R28.1 U6.10(~{5Y}) ; port Sensor 5
Sensor 6: R29.1 U6.12(~{6Y}) ; port Sensor 6
NetQ1_1: Q1.1(A) R1.1
NetQ2_1: Q2.1(A) R2.1
NetQ3_1: Q3.1(A) R5.1
NetQ4_1: Q4.1(A) R6.1
NetQ5_1: Q5.1(A) R9.1
NetQ6_1: Q6.1(A) R10.1

### Notes on the sheet
- Sensor Outputs
- Sensors need to be placed at the bottom
- 4
- 3
- DWG NO.
- REV
- 2
- 1
- ALL INFORMATION IN THIS DRAWING IS THE PROPERTY OF EMAC, AND CANNOT BE COPIED OR USED WITHOUT THE WRITTEN APPROVAL OF EMAC.
- D
- C
- B
- 2025 Bright Manufacturing Challenge
- SCHEMATIC
- A
- SIZE
- CODE IDENT
- 0BJZ8
- NONE
- SCALE
- WEIGHT
- NA
- SHEET
- OF
- REV. A, 06/21/2025
- FORM #PDE-0001-0001

### Library data of the parts
C31 = CMP-00000-2: as C18 on sheet MCU; Height: 0.9mm; Capacitor Type: Ceramic; Case/Package: 0603; Dielectric Material: Ceramic; JESD-609 Code: e3; Length: 1.6mm; Max Operating Temperature: 125°C; Min Operating Temperature: -55°C; Mounting Technology: Surface Mount; Package Shape: Rectangular; Package Style: SMTMeter; Packaging: Tape and Reel; Pins: 2; Reach SVHC Compliant: Yes; RoHS Compliant: Yes; Temperature Characteristics Code: X7R; Terminal Finish: Nickel; Termination: Wraparound; Tolerance  (fill in as +-): 10%; Tolerance (fill in as +-): 10%; Width: 0.81mm
Q1-Q6 = CMP-00014-1: Diffuse Photoelectric Sensor, 0mm Min, 5mm Max, 0.30-1mA, 1-Channel, Square, Through Hole Mount; Body Breadth: 7mm; Body Height: 6mm; Gap Size: 7.6mm; Max Output Voltage: 32V; Max Supply Voltage: 1.6V; Min Supply Voltage: 1.25V; Number of Channels: 1; Operating Current-Max: 50mA; Output Circuit Type: TRANSISTOR; Output Type: Analog Current; Sensor Type: LINEAR POSITION SENSOR,PHOTOELECTRIC,DIFFUSE; VCEsat-Max: 300mV; Body Length or Diameter: 7mm; Max Operating Temperature: 85°C; Measurement Range-Max (mm): 5mm; Measurement Range-Min (mm): 0mm; Min Operating Temperature: -40°C; Mounting Technology: Through Hole; Output Range: 0.30-1mA; Package Shape/Style: Square; Reach SVHC Compliant: Yes; RoHS Compliant: Yes; Termination: Solder
R1 R2 R5 R6 R9 R10 = CMP-2000-04607-2: RES SMD 100 OHM 0.5% 1/10W 0603; Manufacturer Part Number: RT0603DRE07100RL; Manufacturer: Yageo; Voltage Rating: 75V; Power Rating: 0.1W; Tolerance: 0.005; Value: 100Ω; Temperature Coefficient: 50 ppm/°C; ComponentLink2URL: http://www.yageo.com/documents/recent/PYu-RT_1-to-0.01_RoHS_L_9.pdf; ComponentLink2Description: Datasheet; Composition: Thin Film; Temperature Range High: +155°C; Height: 0.55mm; RoHS: TRUE; Octopart: https://octopart.com/rt0603dre07100rl-yageo-1441481; Temperature: -55°C to +155°C; Temperature Range Low: -55°C; Digikey Description: RES SMD 100 OHM 0.5% 1/10W 0603; Ipc Land Pattern Name: RESC16080X45; Device Class L1: Passive Components; Automotive: No; Lead Free: Yes; Device Class L2: Resistors; Package: RT0603; Category: Res; Footprint Url: http://www.yageo.com/exep/pages/download/literatures/PYu-R_Mount_10.pdf; Resistance: 100Ω; Device Class L3: Chip SMD Resistors; Series: RT
R3 R4 R7 R8 R11 R12 = CMP-00018-1: as R18 on sheet MCU; Packaging: Tape and Reel; Tolerance: 5%; Case/Package: 0603; Construction: Chip; JESD-609 Code: e3; Max Operating Temperature: 155°C; Min Operating Temperature: -55°C; Mounting Technology: Surface Mount; Package Shape: Rectangular; Pins: 2; Reach SVHC Compliant: Yes; Resistor Type: FIXED RESISTOR; RoHS Compliant: Yes; Technology: METAL GLAZE/THICK FILM; Terminal Finish: Nickel; Termination: Wraparound; Working Voltage: 75V
R24-R29 = CMP-2000-06925-2: as R23 on sheet Power Supply; Composition: Thick Film; Temperature Range Low: -55°C; Ipc Land Pattern Name: RESC16080X45; Lead Free: Yes; Digikey Description: RES SMD 0 OHM JUMPER 1/10W 0603; Height: 0.55mm; Automotive: No; Device Class L3: Chip SMD Resistors; Device Class L1: Passive Components; Device Class L2: Resistors; Footprint Url: http://www.yageo.com/exep/pages/download/literatures/PYu-R_Mount_10.pdf; Category: Res; Mouser Description: RC Series 0603 0.1 W 0 O Jumper Surface Mount Thick Film Chip Resistor; Resistance: 0Ω; ComponentLink2URL: http://www.yageo.com/documents/recent/PYu-RC_Group_51_RoHS_L_10.pdf; Series: RC_L; ComponentLink2Description: Datasheet; RoHS: TRUE; Temperature: -55°C to +155°C; Temperature Range High: +155°C; Package: RC0603; Octopart: https://octopart.com/rc0603fr-070rl-yageo-1180803
U6 = CMP-00021-8: Inverter, HC Series, 6-Func, 1-Input, CMOS, PDSO14; Propagation Delay (tpd): 155ns; Package Body Material: Plastic; Package Equivalence Code: SOP14,.3; Nominal Supply Voltage: 5V; Schmitt Trigger: Yes; Channels: 6; Min Supply Voltage: 2V; Load Capacitance (CL): 50pF; Prop. Delay@Nom-Sup: 31ns; Qualification Status: Not Qualified; Max Supply Voltage: 6V; Max I(ol): 4mA; Power Supplies: 2/6V; Number of Inputs: 1; JESD-30 Code: R-PDSO-G14; Pins: 14; Moisture Sensitivity Level: 1; Terminal Finish: Nickel; Terminal Pitch: 1.27mm; Height - Seated (Max): 2mm; JESD-609 Code: e4; RoHS Compliant: Yes; Terminal Position: DUAL; Logic Type: INVERTER; Length: 10.2mm; Max Operating Temperature: 85°C; Package Style: SMALL OUTLINEMeter; Technology: CMOS; Reach SVHC Compliant: Yes; Case/Package: SOP; Package Shape: Rectangular; Width: 5.3mm; Min Operating Temperature: -40°C; Load/Preset Input: Yes; Peak Reflow Temperature (Cel): 260°C; Surface Mount: Yes; Terminal Form: Gull Wing; Packaging: Tape and Reel; Temperature Grade: INDUSTRIAL

## Sheet Additional Feature.SchDoc: Team Additional Feature
size 431 x 279 mm; DocumentNumber: BMC-125-5321; Revision: A; SheetNumber: 6; SheetTotal: 6
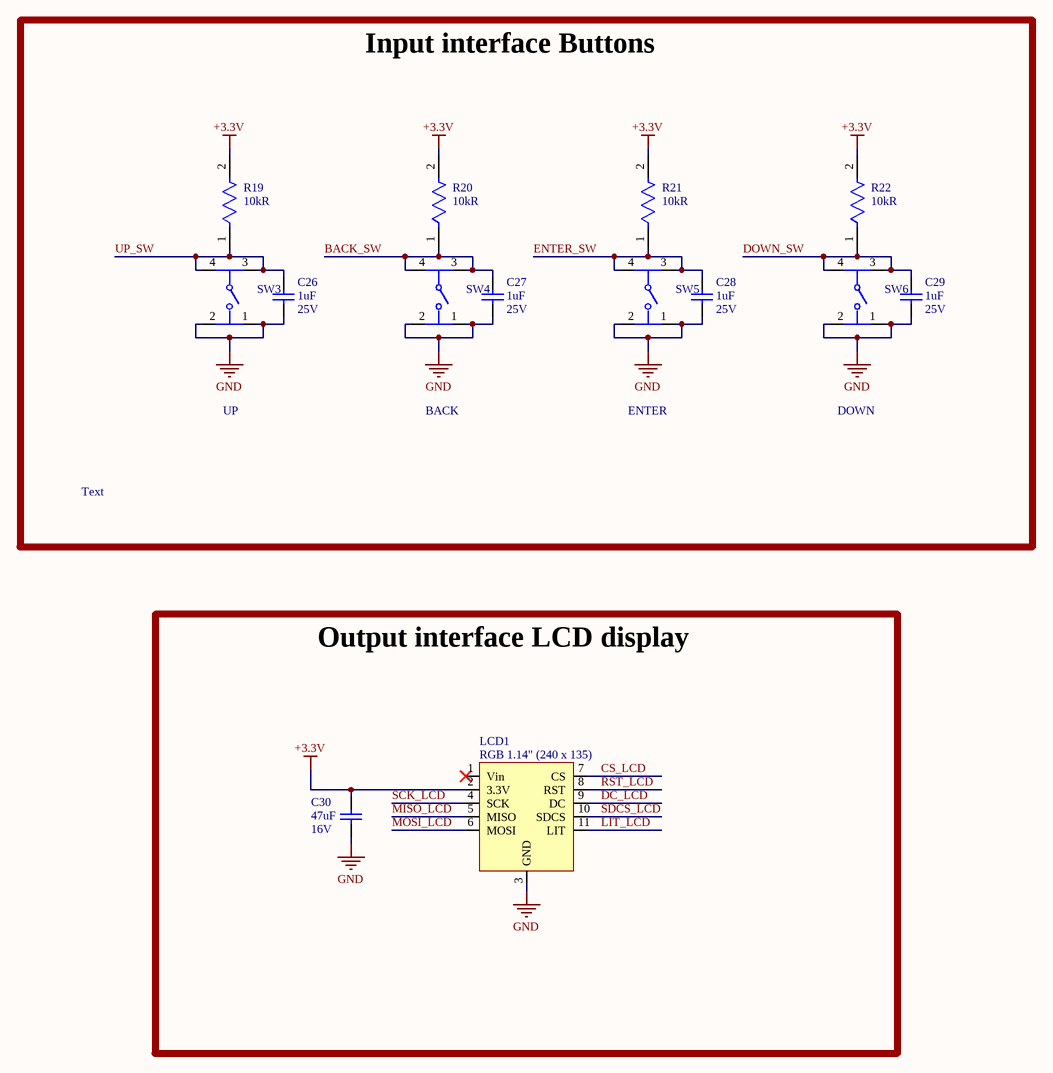
[diagram p5: Additional Feature.SchDoc]

### Parts
C26  value 1uF  Rated DC Voltage (URdc): 25V  [FP-CC0603-DA-IPC_B]  (hidden comment: 1uF 25V 0603)
C27  value 1uF  Rated DC Voltage (URdc): 25V  [FP-CC0603-DA-IPC_B]  (hidden comment: 1uF 25V 0603)
C28  value 1uF  Rated DC Voltage (URdc): 25V  [FP-CC0603-DA-IPC_B]  (hidden comment: 1uF 25V 0603)
C29  value 1uF  Rated DC Voltage (URdc): 25V  [FP-CC0603-DA-IPC_B]  (hidden comment: 1uF 25V 0603)
C30  value 47uF  Rated DC Voltage (URdc): 16V  [FP-1210-L_3_2_0_3-W_2_5_0-MFG]  (hidden comment: CAP)
LCD1  RGB 1.14" (240 x 135)  [PCBComponent_1]
R19  value 10kR  [RESC1608X55X25ML10T15]  (hidden comment: 10KOhm 0603)
R20  value 10kR  [RESC1608X55X25ML10T15]  (hidden comment: 10KOhm 0603)
R21  value 10kR  [RESC1608X55X25ML10T15]  (hidden comment: 10KOhm 0603)
R22  value 10kR  [RESC1608X55X25ML10T15]  (hidden comment: 10KOhm 0603)
SW3  PTS645SM43SMTR92LFS  [FP-PTS645SM43SMTR92LFS-MFG]  (value not drawn)
SW4  PTS645SM43SMTR92LFS  [FP-PTS645SM43SMTR92LFS-MFG]  (value not drawn)
SW5  PTS645SM43SMTR92LFS  [FP-PTS645SM43SMTR92LFS-MFG]  (value not drawn)
SW6  PTS645SM43SMTR92LFS  [FP-PTS645SM43SMTR92LFS-MFG]  (value not drawn)

### Blocks framed on the sheet
Input interface Buttons: C26-C29 R19-R22 SW3-SW6
Output interface LCD display: C30 LCD1

### Nets
+3.3V: C30.2 LCD1.2(3.3V) R19.2 R20.2 R21.2 R22.2
GND: C26.1 C27.1 C28.1 C29.1 C30.1 LCD1.3(GND) SW3.1 SW3.2 SW4.1 SW4.2 SW5.1 SW5.2 SW6.1 SW6.2
BACK_SW: C27.2 R20.1 SW4.3 SW4.4
CS_LCD: LCD1.7(CS)
DC_LCD: LCD1.9(DC)
DOWN_SW: C29.2 R22.1 SW6.3 SW6.4
ENTER_SW: C28.2 R21.1 SW5.3 SW5.4
LIT_LCD: LCD1.11(LIT)
MISO_LCD: LCD1.5(MISO)
MOSI_LCD: LCD1.6(MOSI)
RST_LCD: LCD1.8(RST)
SCK_LCD: LCD1.4(SCK)
SDCS_LCD: LCD1.10(SDCS)
UP_SW: C26.2 R19.1 SW3.3 SW3.4

Not connected (* = marked no-connect by the designer): LCD1 1(Vin)*

### Notes on the sheet
- UP
- BACK
- ENTER
- DOWN
- Text
- 4
- 3
- DWG NO.
- REV
- 2
- 1
- ALL INFORMATION IN THIS DRAWING IS THE PROPERTY OF EMAC, AND CANNOT BE COPIED OR USED WITHOUT THE WRITTEN APPROVAL OF EMAC.
- D
- C
- B
- 2025 Bright Manufacturing Challenge
- SCHEMATIC
- A
- SIZE
- CODE IDENT
- 0BJZ8
- NONE
- SCALE
- WEIGHT
- NA
- SHEET
- OF
- REV. A, 06/21/2025
- FORM #PDE-0001-0001

### Library data of the parts
C26-C29 = CMP-00002-5: as C24 on sheet MCU; Height: 0.8mm; Capacitor Type: Ceramic; Case/Package: 0603; Dielectric Material: Ceramic; JESD-609 Code: e3; Length: 1.6mm; Max Operating Temperature: 85°C; Min Operating Temperature: -55°C; Mounting Technology: Surface Mount; Package Shape: Rectangular; Package Style: SMTMeter; Packaging: Tape and Reel; Pins: 2; Reach SVHC Compliant: Yes; RoHS Compliant: Yes; Temperature Characteristics Code: X5R; Terminal Finish: Nickel; Termination: Wraparound; Tolerance  (fill in as +-): 10%; Tolerance (fill in as +-): 10%; Width: 0.8mm; Voltage Rating: 25V
C30 = CMP-00003-4: as C6 on sheet Power Supply; Capacitor Type: Ceramic; Case/Package: 1210; Dielectric Material: Ceramic; Height: 2.5mm; JESD-609 Code: e3; Length: 3.2mm; Max Operating Temperature: 85°C; Min Operating Temperature: -55°C; Mounting Technology: Surface Mount; Package Shape: Rectangular; Package Style: SMTMeter; Packaging: Tape and Reel; Pins: 2; Reach SVHC Compliant: Yes; RoHS Compliant: Yes; Temperature Characteristics Code: X5R; Terminal Finish: Nickel; Termination: Wraparound; Tolerance  (fill in as +-): 20%; Tolerance (fill in as +-): 20%; Voltage Rating: 16V; Width: 2.5mm
LCD1 = RGB 1.14" (240 x 135): GRAPHIC DISPLAY TFT RGB 1.14"; Manufacturer: Adafruit Industries LLC; Manufacturer Part Number: 4383; Display Type: TFT - Color; Screen Size: 1.14" (28.96mm); Dot Pixel: 240 x 135; Dot Pixels: 240 x 135; Supplier 1: Digikey; Supplier Part Number 1: 1528-4383-ND
R19-R22 = CMP-00018-1: as R18 on sheet MCU; Packaging: Tape and Reel; Tolerance: 5%; Case/Package: 0603; Construction: Chip; JESD-609 Code: e3; Max Operating Temperature: 155°C; Min Operating Temperature: -55°C; Mounting Technology: Surface Mount; Package Shape: Rectangular; Pins: 2; Reach SVHC Compliant: Yes; Resistor Type: FIXED RESISTOR; RoHS Compliant: Yes; Technology: METAL GLAZE/THICK FILM; Terminal Finish: Nickel; Termination: Wraparound; Working Voltage: 75V
SW3-SW6 = CMP-00020-2: as SW2 on sheet MCU; Min Operating Temperature: -20°C; Termination: Solder; Switch Function: SPST; Max Operating Temperature: 60°C; Body Length or Diameter: 5.9944mm; JESD-609 Code: e4; Mounting Technology: Surface Mount; Reach SVHC Compliant: Yes; RoHS Compliant: Yes; Switch Action: MOMENTARY; Switch Type: Keypad; Terminal Finish: Silver; Terminal Length: 0.138inch

## Nets that join several sheets
+3.3V: MCU (12 pins), Motor controllers (U1.4 U2.4), Power Supply (C16.2 C17.2 U4.2 U4.4), Sensors (14 pins), Additional Feature (6 pins)
+8.8V: Motor controllers (6 pins), Power Supply (6 pins)
GND: MCU (16 pins), Motor controllers (10 pins), Power Supply (19 pins), Sensors (14 pins), Additional Feature (14 pins)
BACK_SW: MCU (U5.41), Additional Feature (C27.2 R20.1 SW4.3 SW4.4)
CS_LCD: MCU (U5.25), Additional Feature (LCD1.7)
DC_LCD: MCU (U5.21), Additional Feature (LCD1.9)
DOWN_SW: MCU (U5.43), Additional Feature (C29.2 R22.1 SW6.3 SW6.4)
ENTER_SW: MCU (U5.42), Additional Feature (C28.2 R21.1 SW5.3 SW5.4)
LIT_LCD: MCU (U5.45), Additional Feature (LCD1.11)
MISO_LCD: MCU (U5.27), Additional Feature (LCD1.5)
MOSI_LCD: MCU (U5.28), Additional Feature (LCD1.6)
MOT-A_INPUT1: MCU (U5.29), Motor controllers (U1.2)
MOT-A_INPUT2: MCU (U5.30), Motor controllers (U1.3)
MOT-B_INPUT1: MCU (U5.31), Motor controllers (U2.2)
MOT-B_INPUT2: MCU (U5.32), Motor controllers (U2.3)
RST_LCD: MCU (U5.22), Additional Feature (LCD1.8)
SCK_LCD: MCU (U5.26), Additional Feature (LCD1.4)
SDCS_LCD: MCU (U5.46), Additional Feature (LCD1.10)
Sensor 1: MCU (U5.10), Sensors (R24.1 U6.2)
Sensor 2: MCU (U5.11), Sensors (R25.1 U6.4)
Sensor 3: MCU (U5.12), Sensors (R26.1 U6.6)
Sensor 4: MCU (U5.13), Sensors (R27.1 U6.8)
Sensor 5: MCU (U5.14), Sensors (R28.1 U6.10)
Sensor 6: MCU (U5.15), Sensors (R29.1 U6.12)
UP_SW: MCU (U5.40), Additional Feature (C26.2 R19.1 SW3.3 SW3.4)